# EAGLE schematic BATT_BUTTONS (EAGLE 9.6.2)
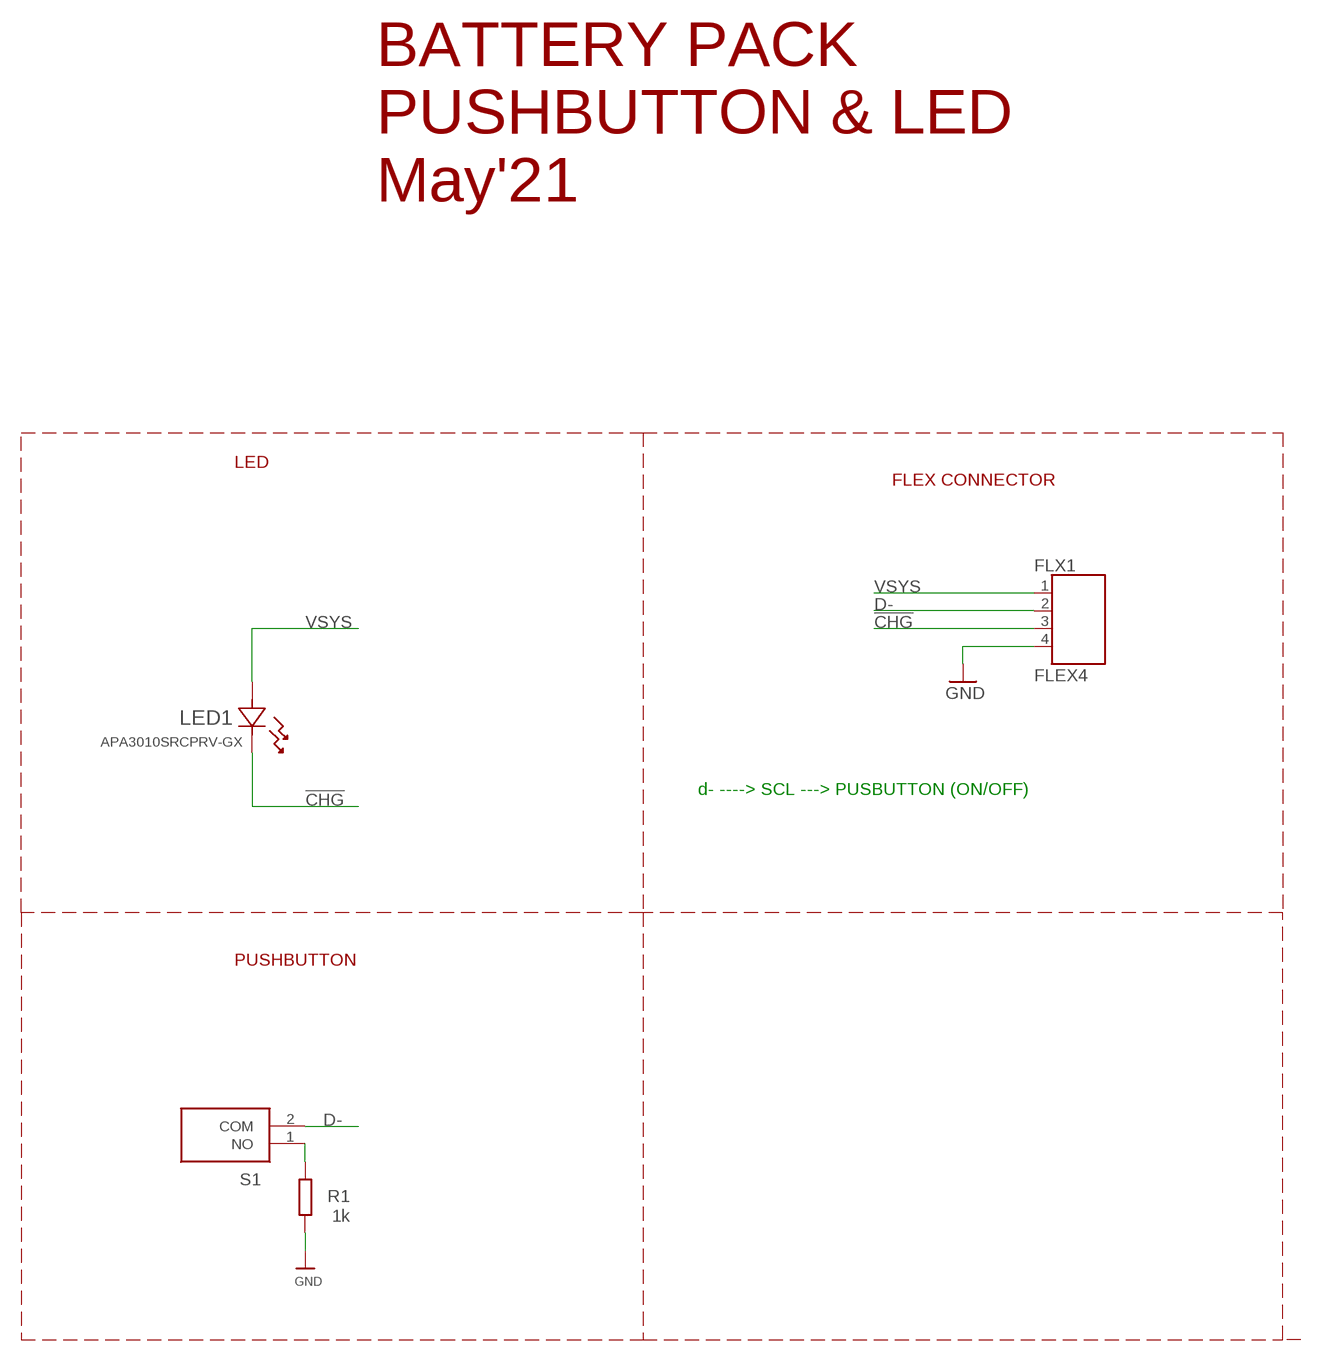
[diagram p0: schematic, sheet 1]

## Parts
FLX1  FLEX4  [FLEX4]
LED1  APA3010SRCPRV-GX  [LED_APA3010SRCPRV-GX_KNB]
R1  1k  R-EU_R0603  [R0603]
S1  KXT311LHS  [KXT311LHS]

## Nets
!CHG!: FLX1.3 LED1.1
D-: FLX1.2 S1.2(COM)
GND: FLX1.4 R1.1
N$1: R1.2 S1.1(NO)
VSYS: FLX1.1 LED1.2

## Notes on the sheet
- BATTERY PACK
  PUSHBUTTON & LED
  May'21
- LED
- FLEX CONNECTOR
- d- ----> SCL ---> PUSBUTTON (ON/OFF)
- PUSHBUTTON

## Library data of the parts
FLX1 = Flex4:FLEX4
LED1 = APA3010 Led:APA3010SRCPRV-GX; BUILT_BY: EMA_Cory; COPYRIGHT: Copyright (C) 2018 Accelerated Designs. All rights reserved; DATASHEET: https://www.kingbrightusa.com/images/catalog/SPEC/APA3010SRCPRV-GX.pdf; MANUFACTURER_PART_NUMBER: APA3010SRCPRV-GX; SOURCELIBRARY: Add_to_database_2020-11-13; VENDOR: Kingbright
R1 = rcl:R-EU_: RESISTOR, European symbol; SPICEPREFIX: R
S1 = switch momentary CK KXT311LHS:KXT311LHS: Tactile Switches 20mA 15VDC 100gf 0.6mm SPST NO SMT Source: Datasheet <https://datasheet.lcsc.com/szlcsc/C-K-KXT311LHS_C221820.pdf>; DESCRIPTION: Tactile Switches 20mA 15VDC 100gf 0.6mm SPST NO SMT; HEIGHT: 0.7mm; MANUFACTURER_NAME: C & K COMPONENTS; MANUFACTURER_PART_NUMBER: KXT311LHS; MOUSER_PART_NUMBER: 611-KXT311LHS; MOUSER_PRICE-STOCK: https://www.mouser.co.uk/ProductDetail/CK/KXT311LHS/?qs=%2FQ2qp2Z%2FWFxZqSWVDr5IpA%3D%3D

## Net classes
1 power: width 0.178 mm
2 gnd: width 0.305 mm, drill 0.483 mm, clearance 0.203 mm